# Altium schematic sheet Schematic.SchDoc (part 1 of 3)
size A2
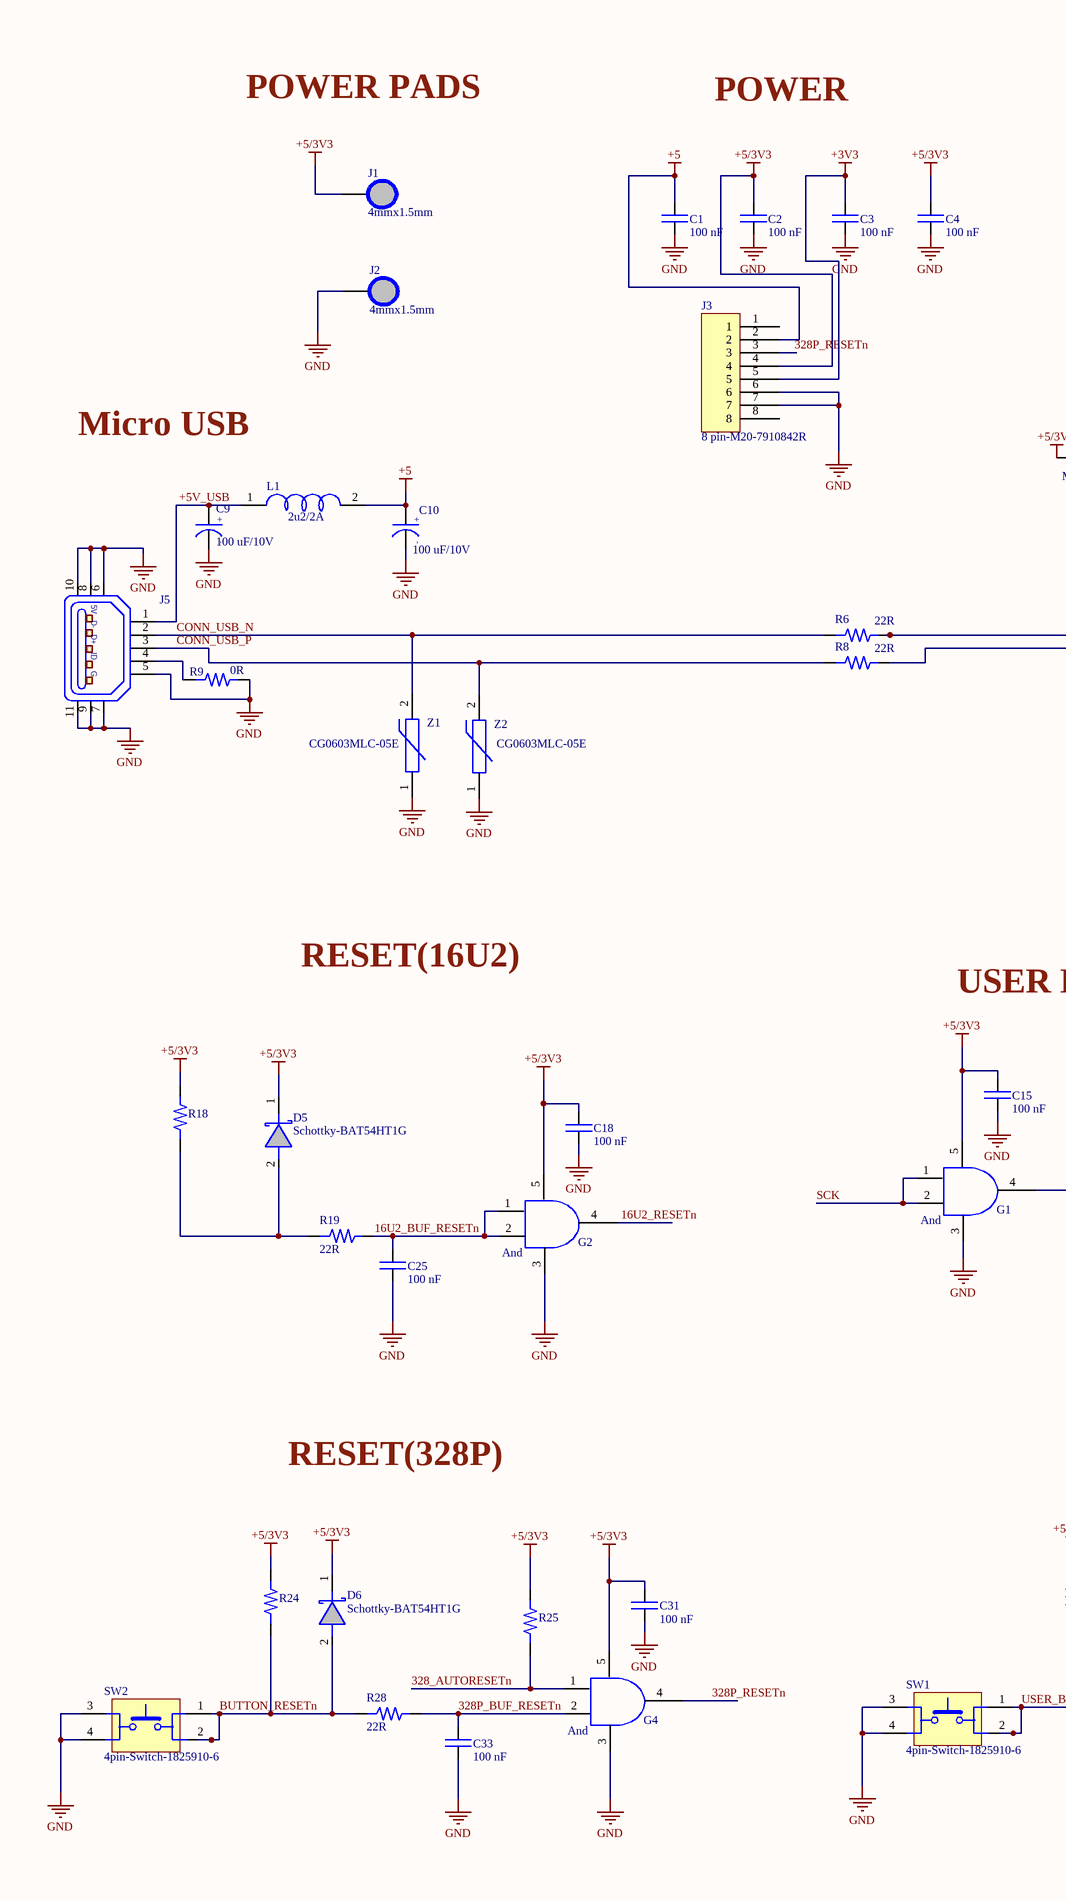
[diagram p0: Schematic.SchDoc, left]
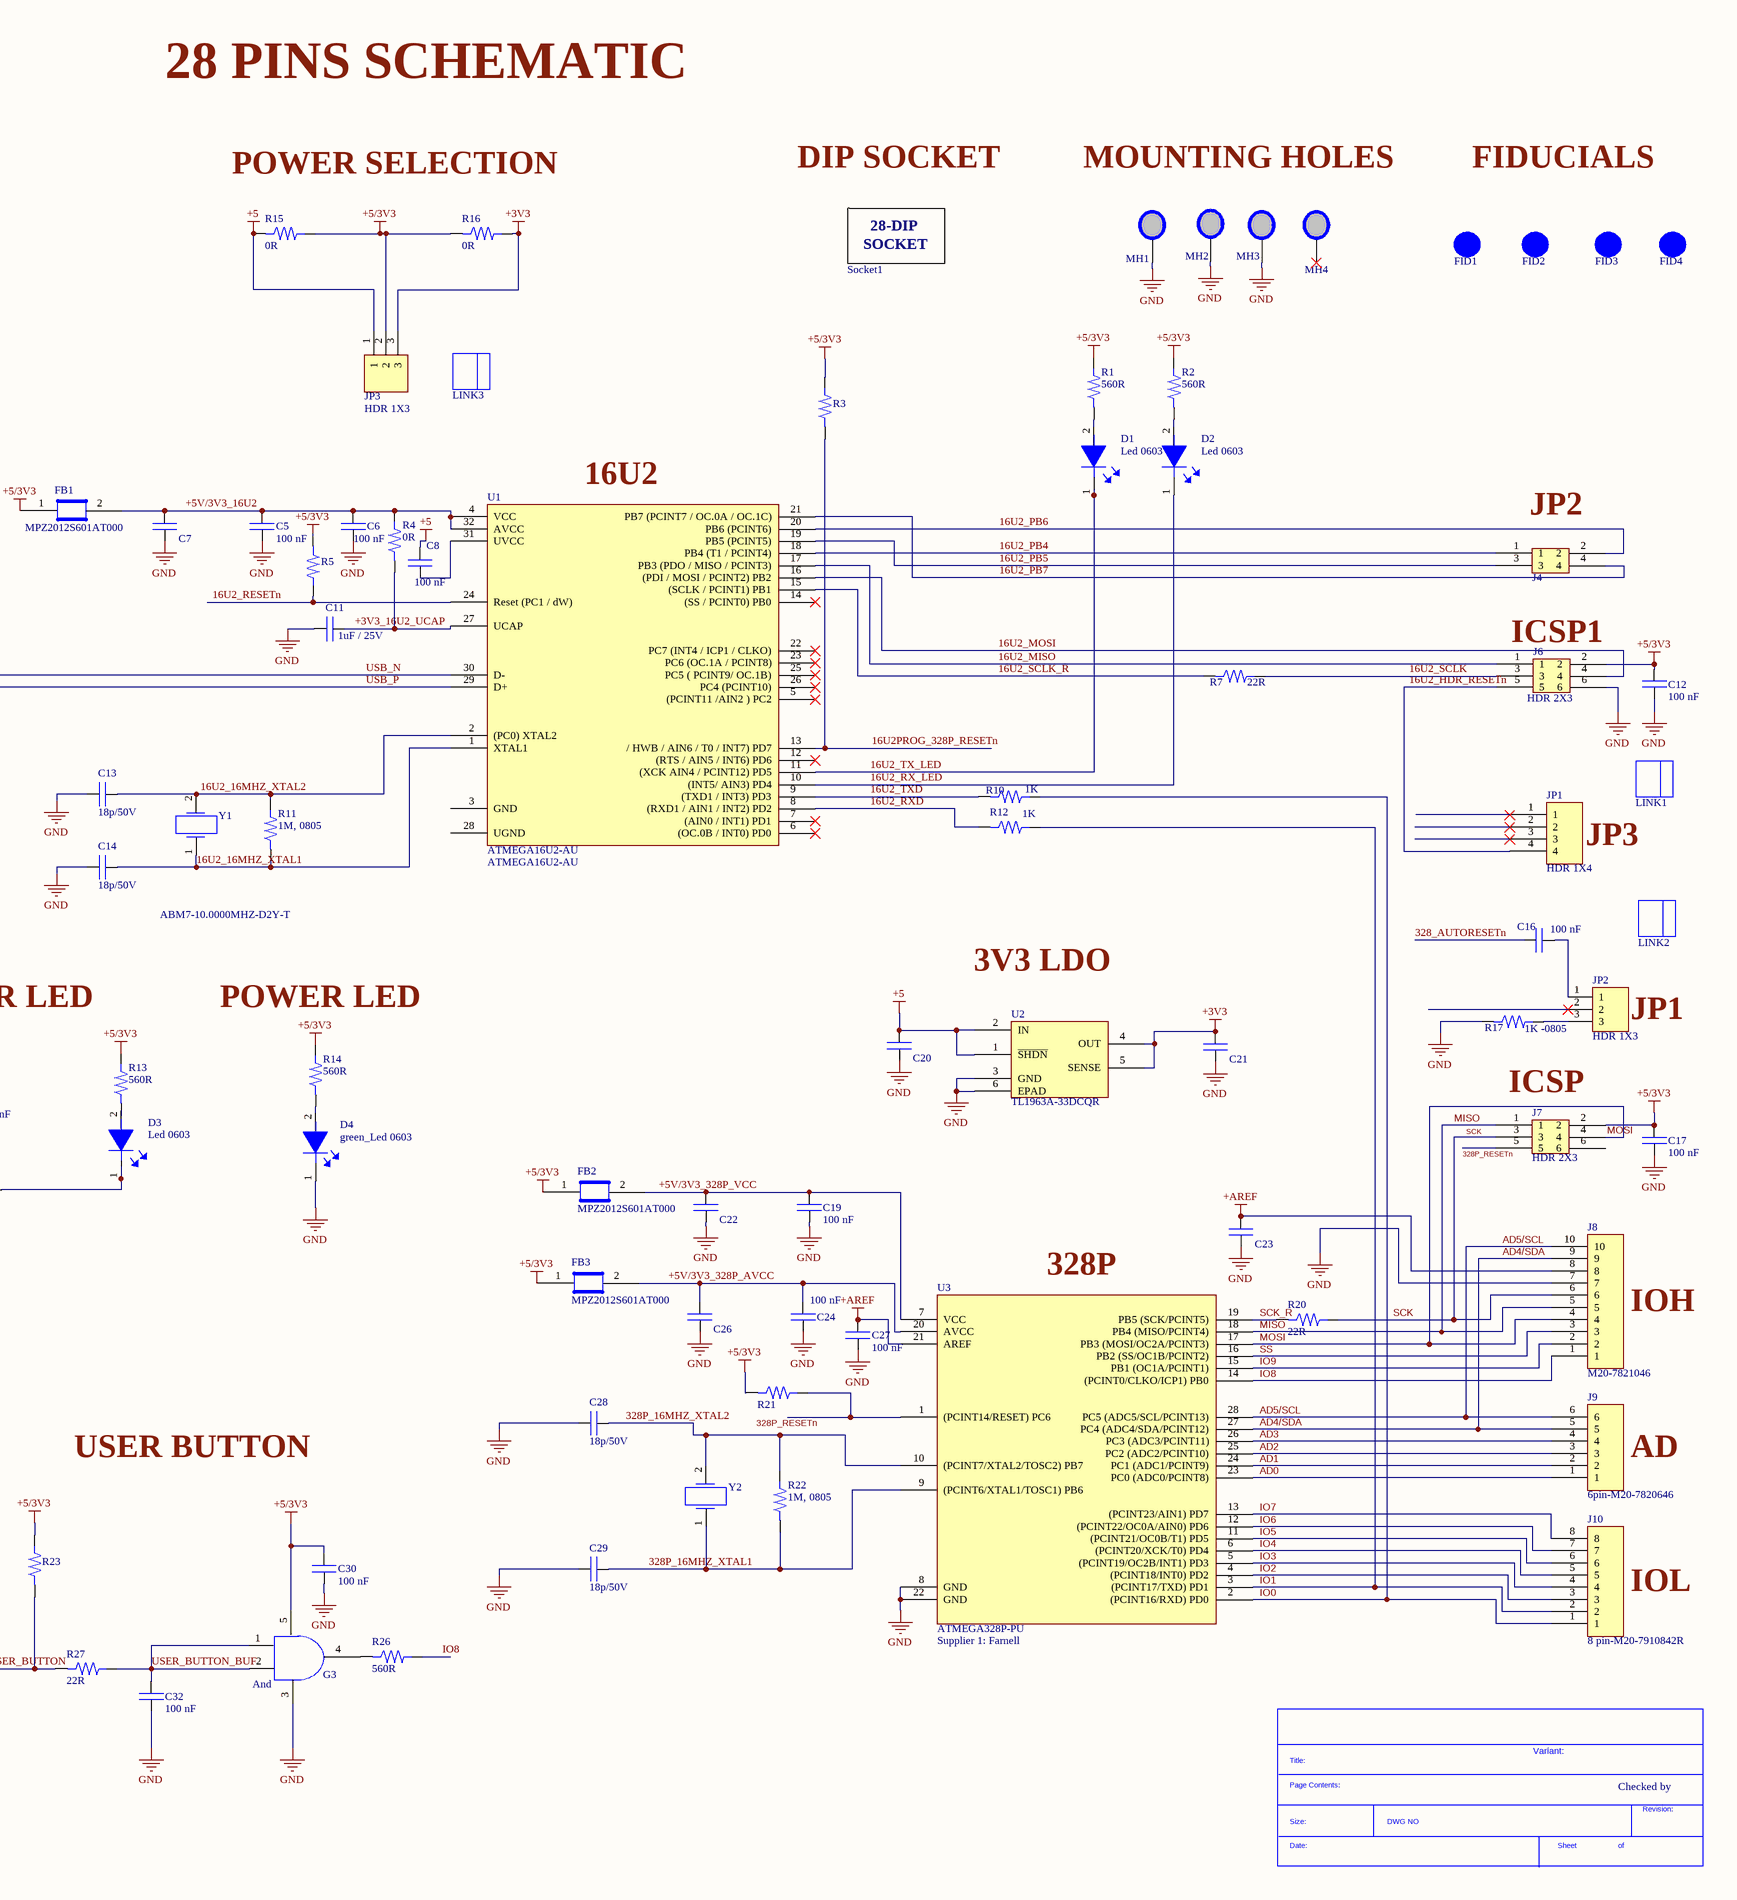
[diagram p1: Schematic.SchDoc, right]

## Parts
*?  SDTitleBlock  (value not drawn)  (graphical)
C1  100 nF  [C0805]
C2  100 nF  [C0805]
C3  100 nF  [C0805]
C4  100 nF  [C0805]
C5  100 nF  [C0805]
C6  100 nF  [C0805]
C7  10 uF cap, 16V, 0805  [C0805 /10uF]  (value not drawn)
C8  100 nF  [C0805]
C9  100 uF/10V  [C_LU_C_SIZE]
C10  100 uF/10V  [C_LU_C_SIZE]
C11  1uF / 25V  [C0805]
C12  100 nF  [C0805]
C13  18p/50V  [C0805 /10uF]
C14  18p/50V  [C0805 /10uF]
C15  100 nF  [C0805]
C16  100 nF  [C0805]
C17  100 nF  [C0805]
C18  100 nF  [C0805]
C19  100 nF  [C0805]
C20  10 uF cap, 16V, 0805  [C0805 /10uF]  (value not drawn)
C21  10 uF cap, 16V, 0805  [C0805 /10uF]  (value not drawn)
C22  10 uF cap, 16V, 0805  [C0805 /10uF]  (value not drawn)
C23  10 uF cap, 16V, 0805  [C0805 /10uF]  (value not drawn)
C24  100 nF  [C0805]
C25  100 nF  [C0805]
C26  10 uF cap, 16V, 0805  [C0805 /10uF]  (value not drawn)
C27  100 nF  [C0805]
C28  18p/50V  [C0805 /10uF]
C29  18p/50V  [C0805 /10uF]
C30  100 nF  [C0805]
C31  100 nF  [C0805]
C32  100 nF  [C0805]
C33  100 nF  [C0805]
D1  Led 0603  [Led_0603]
D2  Led 0603  [Led_0603]
D3  Led 0603  [Led_0603]
D4  green_Led 0603  [Led_0603]
D5  Schottky-BAT54HT1G  [Schottky-SOD323]
D6  Schottky-BAT54HT1G  [Schottky-SOD323]
FB1  MPZ2012S601AT000  [C0805]
FB2  MPZ2012S601AT000  [C0805]
FB3  MPZ2012S601AT000  [C0805]
FID1  FID_1MMC  [FID_40X120D]  (value not drawn)  (no BOM)
FID2  FID_1MMC  [FID_40X120D]  (value not drawn)  (no BOM)
FID3  FID_1MMC  [FID_40X120D]  (value not drawn)  (no BOM)
FID4  FID_1MMC  [FID_40X120D]  (value not drawn)  (no BOM)
G1  ANDGATE  [DBV_SOT_23_5]  (value not drawn)
G2  ANDGATE  [DBV_SOT_23_5]  (value not drawn)
G3  ANDGATE  [DBV_SOT_23_5]  (value not drawn)
G4  ANDGATE  [DBV_SOT_23_5]  (value not drawn)
J1  4mmx1.5mm  [PAD_WITH_HOLE_4MMx1.5MM]  (no BOM)
J2  4mmx1.5mm  [PAD_WITH_HOLE_4MMx1.5MM]  (no BOM)
J3  8 pin-M20-7910842R  [8 pin female header]
J4  HDR 2x2  [HDR_2X2_2.54mm]  (value not drawn)
J5  Connector/10118193-0001LF  [CONNECTOR]  (value not drawn)
J6  HDR 2X3  [HDR_2X3_2.54mm]
J7  HDR 2X3  [HDR_2X3_2.54mm]
J8  M20-7821046  [10 pin female header]
J9  6pin-M20-7820646  [6 pin female header]
J10  8 pin-M20-7910842R  [8 pin female header]
JP1  HDR 1X4  [HDR_1X4_2.54mm]
JP2  HDR 1X3  [HDR_1X3_2.54mm]
JP3  HDR 1X3  [HDR_1X3_2.54mm]
L1  2u2/2A  [C1210_IND]
LINK1  LINK  (value not drawn)  (mechanical)
LINK2  LINK  (value not drawn)  (mechanical)
LINK3  LINK  (value not drawn)  (mechanical)
MH1  MH_7.4MMC_3.2MMD  [MH_7.4MMC_3.2MMD]  (value not drawn)  (no BOM)
MH2  MH_7.4MMC_3.2MMD  [MH_7.4MMC_3.2MMD]  (value not drawn)  (no BOM)
MH3  MH_7.4MMC_3.2MMD  [MH_7.4MMC_3.2MMD]  (value not drawn)  (no BOM)
MH4  MH_7.4MMHC_3.2MMD  [MH_7.4MMHC_3.2MMD_NoCopper]  (value not drawn)  (no BOM)
R1  560R  [R0805]
R2  560R  [R0805]
R3  100K, 0805  [R0805]  (value not drawn)
R4  0R  [R0805]
R5  10K 0805  [R0805]  (value not drawn)
R6  22R  [R0805]
R7  22R  [R0805]
R8  22R  [R0805]
R9  0R  [R0805]
R10  1K  [R0805]
R11  1M, 0805  [R0805]
R12  1K  [R0805]
R13  560R  [R0805]
R14  560R  [R0805]
R15  0R  [R0805]
R16  0R  [R0805]
R17  1K -0805  [R0805]
R18  10K 0805  [R0805]  (value not drawn)
R19  22R  [R0805]
R20  22R  [R0805]
R21  10K 0805  [R0805]  (value not drawn)
R22  1M, 0805  [R0805]
R23  10K 0805  [R0805]  (value not drawn)
R24  10K 0805  [R0805]  (value not drawn)
R25  10K 0805  [R0805]  (value not drawn)
R26  560R  [R0805]
R27  22R  [R0805]
R28  22R  [R0805]
Socket1  4828-3004-CP  [28_DIP_7.62mm_SOCKET]  (value not drawn)
SW1  4pin-Switch-1825910-6  [4Switch-1825910-6]
SW2  4pin-Switch-1825910-6  [4Switch-1825910-6]
U1  ATMEGA16U2-AU  [TQFP32]
U2  TL1963A-33DCQR  [DSQ (R-PDSO-G6)]
U3  ATMEGA328P-PU  Supplier 1: Farnell  [DIP28]
Y1  ABM7-10.0000MHZ-D2Y-T  [ABM7-16.000MHZ-D2Y-T]
Y2  ABM7-10.0000MHZ-D2Y-T  [ABM7-16.000MHZ-D2Y-T]  (value not drawn)
Z1  CG0603MLC-05E  [R0603]
Z2  CG0603MLC-05E  [R0603]

## Nets
+3V3: C3.2 C21.2 J3.5 JP3.3 R16.2 U2.4(OUT) U2.5(SENSE)
+5: C1.2 C8.2 C10.1 C20.2 J3.2 JP3.1 L1.2 R15.1 U2.1(~{SHDN}) U2.2(IN)
+5/3V3: C2.2 C4.2 C12.1 C15.2 C17.2 C18.2 C30.2 C31.2 D5.1(Katothe) D6.1(Katothe) FB1.1 FB2.1 FB3.1 G1.5 G2.5 G3.5 G4.5 J1.1 J3.4 J6.2 J7.2 JP3.2 R1.2 R2.2 R3.2 R5.1 R13.2 R14.2 R15.2 R16.1 R18.2 R21.1 R23.2 R24.2 R25.2
+AREF: C23.2 C27.2 J8.8 U3.21(AREF)
GND: C1.1 C2.1 C3.1 C4.1 C5.1 C6.1 C7.1 C9.2 C10.2 C11.1 C12.2 C13.1 C14.1 C15.1 C17.1 C18.1 C19.1 C20.1 C21.1 C22.1 C23.1 C24.1 C25.1 C26.1 C27.1 C28.1 C29.1 C30.1 C31.1 C32.1 C33.1 D4.1(Katothe) G1.3 G2.3 G3.3 G4.3 J2.1 J3.6 J3.7 J5.5 J5.6 J5.7 J5.8 J5.9 J5.10 J5.11 J6.6 J8.7 MH1.1 MH2.1 MH3.1 R9.2 R17.1 SW1.3 SW1.4 SW2.3 SW2.4 U2.3(GND) U2.6(EPAD) U3.8(GND) U3.22(GND) Z1.1 Z2.1
16U2_16MHZ_XTAL1: C14.2 R11.1 U1.1(XTAL1) Y1.1
16U2_16MHZ_XTAL2: C13.2 R11.2 U1.2((PC0)_XTAL2) Y1.2
16U2_BUF_RESETn: C25.2 G2.1 G2.2 R19.2
16U2_HDR_RESETn: J6.5 JP1.4
16U2_MISO: J6.1 U1.17(PB3_(PDO_/_MISO_/_PCINT3))
16U2_MOSI: J6.4 U1.16((PDI_/_MOSI_/_PCINT2)_PB2)
16U2_PB4: J4.1 U1.18(PB4_(T1_/_PCINT4))
16U2_PB5: J4.3 U1.19(PB5_(PCINT5))
16U2_PB6: J4.2 U1.20(PB6_(PCINT6))
16U2_PB7: J4.4 U1.21(PB7_(PCINT7_/_OC.0A_/_OC.1C))
16U2_RESETn: G2.4 R5.2 U1.24(Reset_(PC1_/_dW))
16U2_RX_LED: D2.1(Katothe) U1.10((INT5/_AIN3)_PD4)
16U2_RXD: R12.1 U1.8((RXD1_/_AIN1_/_INT2)_PD2)
16U2_SCLK: J6.3 R7.2
16U2_SCLK_R: R7.1 U1.15((SCLK_/_PCINT1)_PB1)
16U2_TX_LED: D1.1(Katothe) U1.11((XCK_AIN4_/_PCINT12)_PD5)
16U2_TXD: R10.1 U1.9((TXD1_/_INT3)_PD3)
16U2PROG_328P_RESETn: R3.1 U1.13(/_HWB_/_AIN6_/_T0_/_INT7)_PD7)
328_AUTORESETn: C16.2 G4.1 R25.1
328P_16MHZ_XTAL1: C29.2 R22.1 U3.9((PCINT6/XTAL1/TOSC1)_PB6) Y2.1
328P_16MHZ_XTAL2: C28.2 R22.2 U3.10((PCINT7/XTAL2/TOSC2)_PB7) Y2.2
328P_BUF_RESETn: C33.2 G4.2 R28.2
328P_RESETn: G4.4 J3.3 J7.5 R21.2 U3.1((PCINT14/RESET)_PC6)
+3V3_16U2_UCAP: C11.2 R4.1 U1.27(UCAP)
+5V/3V3_16U2: C5.2 C6.2 C7.2 FB1.2 R4.2 U1.4(VCC) U1.32(AVCC)
+5V/3V3_328P_AVCC: C24.2 C26.2 FB3.2 U3.20(AVCC)
+5V/3V3_328P_VCC: C19.2 C22.2 FB2.2 U3.7(VCC)
+5V_USB: C9.1 J5.1 L1.1
AD0: J9.1 U3.23(PC0_(ADC0/PCINT8))
AD1: J9.2 U3.24(PC1_(ADC1/PCINT9))
AD2: J9.3 U3.25(PC2_(ADC2/PCINT10))
AD3: J9.4 U3.26(PC3_(ADC3/PCINT11))
AD4/SDA: J8.9 J9.5 U3.27(PC4_(ADC4/SDA/PCINT12))
AD5/SCL: J8.10 J9.6 U3.28(PC5_(ADC5/SCL/PCINT13))
BUTTON_RESETn: D6.2(Anode) R24.1 R28.1 SW2.1 SW2.2
CONN_USB_N: J5.2 R6.1 Z1.2
CONN_USB_P: J5.3 R8.1 Z2.2
IO0: J10.1 R10.2 U3.2((PCINT16/RXD)_PD0)
IO1: J10.2 R12.2 U3.3((PCINT17/TXD)_PD1)
IO2: J10.3 U3.4((PCINT18/INT0)_PD2)
IO3: J10.4 U3.5((PCINT19/OC2B/INT1)_PD3)
IO4: J10.5 U3.6((PCINT20/XCK/T0)_PD4)
IO5: J10.6 U3.11((PCINT21/OC0B/T1)_PD5)
IO6: J10.7 U3.12((PCINT22/OC0A/AIN0)_PD6)
IO7: J10.8 U3.13((PCINT23/AIN1)_PD7)
IO8: J8.1 R26.2 U3.14((PCINT0/CLKO/ICP1)_PB0)
IO9: J8.2 U3.15(PB1_(OC1A/PCINT1))
MISO: J7.1 J8.5 U3.18(PB4_(MISO/PCINT4))
MOSI: J7.4 J8.4 U3.17(PB3_(MOSI/OC2A/PCINT3))
SCK: G1.1 G1.2 J7.3 J8.6 R20.2
SCK_R: R20.1 U3.19(PB5_(SCK/PCINT5))
SS: J8.3 U3.16(PB2_(SS/OC1B/PCINT2))
USB_N: R6.2 U1.30(D-)
USB_P: R8.2 U1.29(D+)
USER_BUTTON: R23.1 R27.1 SW1.1 SW1.2
USER_BUTTON_BUF: C32.2 G3.1 G3.2 R27.2
NetC8_1: C8.1 U1.31(UVCC)
NetC16_1: C16.1 JP2.1
NetD1_2: D1.2(Anode) R1.1
NetD2_2: D2.2(Anode) R2.1
NetD3_1: D3.1(Katothe) G1.4
NetD3_2: D3.2(Anode) R13.1
NetD4_2: D4.2(Anode) R14.1
NetD5_2: D5.2(Anode) R18.1 R19.1
NetG3_4: G3.4 R26.1
NetJ5_4: J5.4 R9.1
NetJP2_3: JP2.3 R17.2

Not connected (* = marked no-connect by the designer): J3 1 8; J7 6; JP1 1* 2* 3*; JP2 2*; MH4 1*; U1 3(GND) 5((PCINT11_/AIN2_)_PC2)* 6((OC.0B_/_INT0)_PD0)* 7((AIN0_/_INT1)_PD1)* 12((RTS_/_AIN5_/_INT6)_PD6)* 14((SS_/_PCINT0)_PB0)* 22(PC7_(INT4_/_ICP1_/_CLKO))* 23(PC6_(OC.1A_/_PCINT8))* 25(PC5_(_PCINT9/_OC.1B))* 26(PC4_(PCINT10))* 28(UGND)

## Notes on the sheet
- 28 PINS SCHEMATIC
- POWER PADS
- POWER
- POWER SELECTION
- DIP SOCKET
- MOUNTING HOLES
- FIDUCIALS
- Micro USB
- (near U1) 16U2
- (near J4) JP2
- (near J6) ICSP1
- JP3
- RESET(16U2)
- USER LED
- (near R14) POWER LED
- 3V3 LDO
- (near JP2) JP1
- (near J7) ICSP
- (near U3) 328P
- (near J8) IOH
- RESET(328P)
- USER BUTTON
- (near J9) AD
- (near J10) IOL
- Variant:
- Checked by
- (in symbol 4828-3004-CP) 28-DIP; SOCKET
- (in symbol 10118193-0001LF) 5V; D-; D+; ID; G
- (in symbol ANDGATE-SN74AHC1G09DBVR) And
- (in symbol EEE-1AA101WR) +; -
- (in symbol SDTitleBlock) Title:; Page Contents:; Revision:; Size:; DWG NO; Date:; Sheet; of